# Altium schematic sheet Power_tree_page.SchDoc
size A3; SheetNumber: 3; SheetTotal: 5
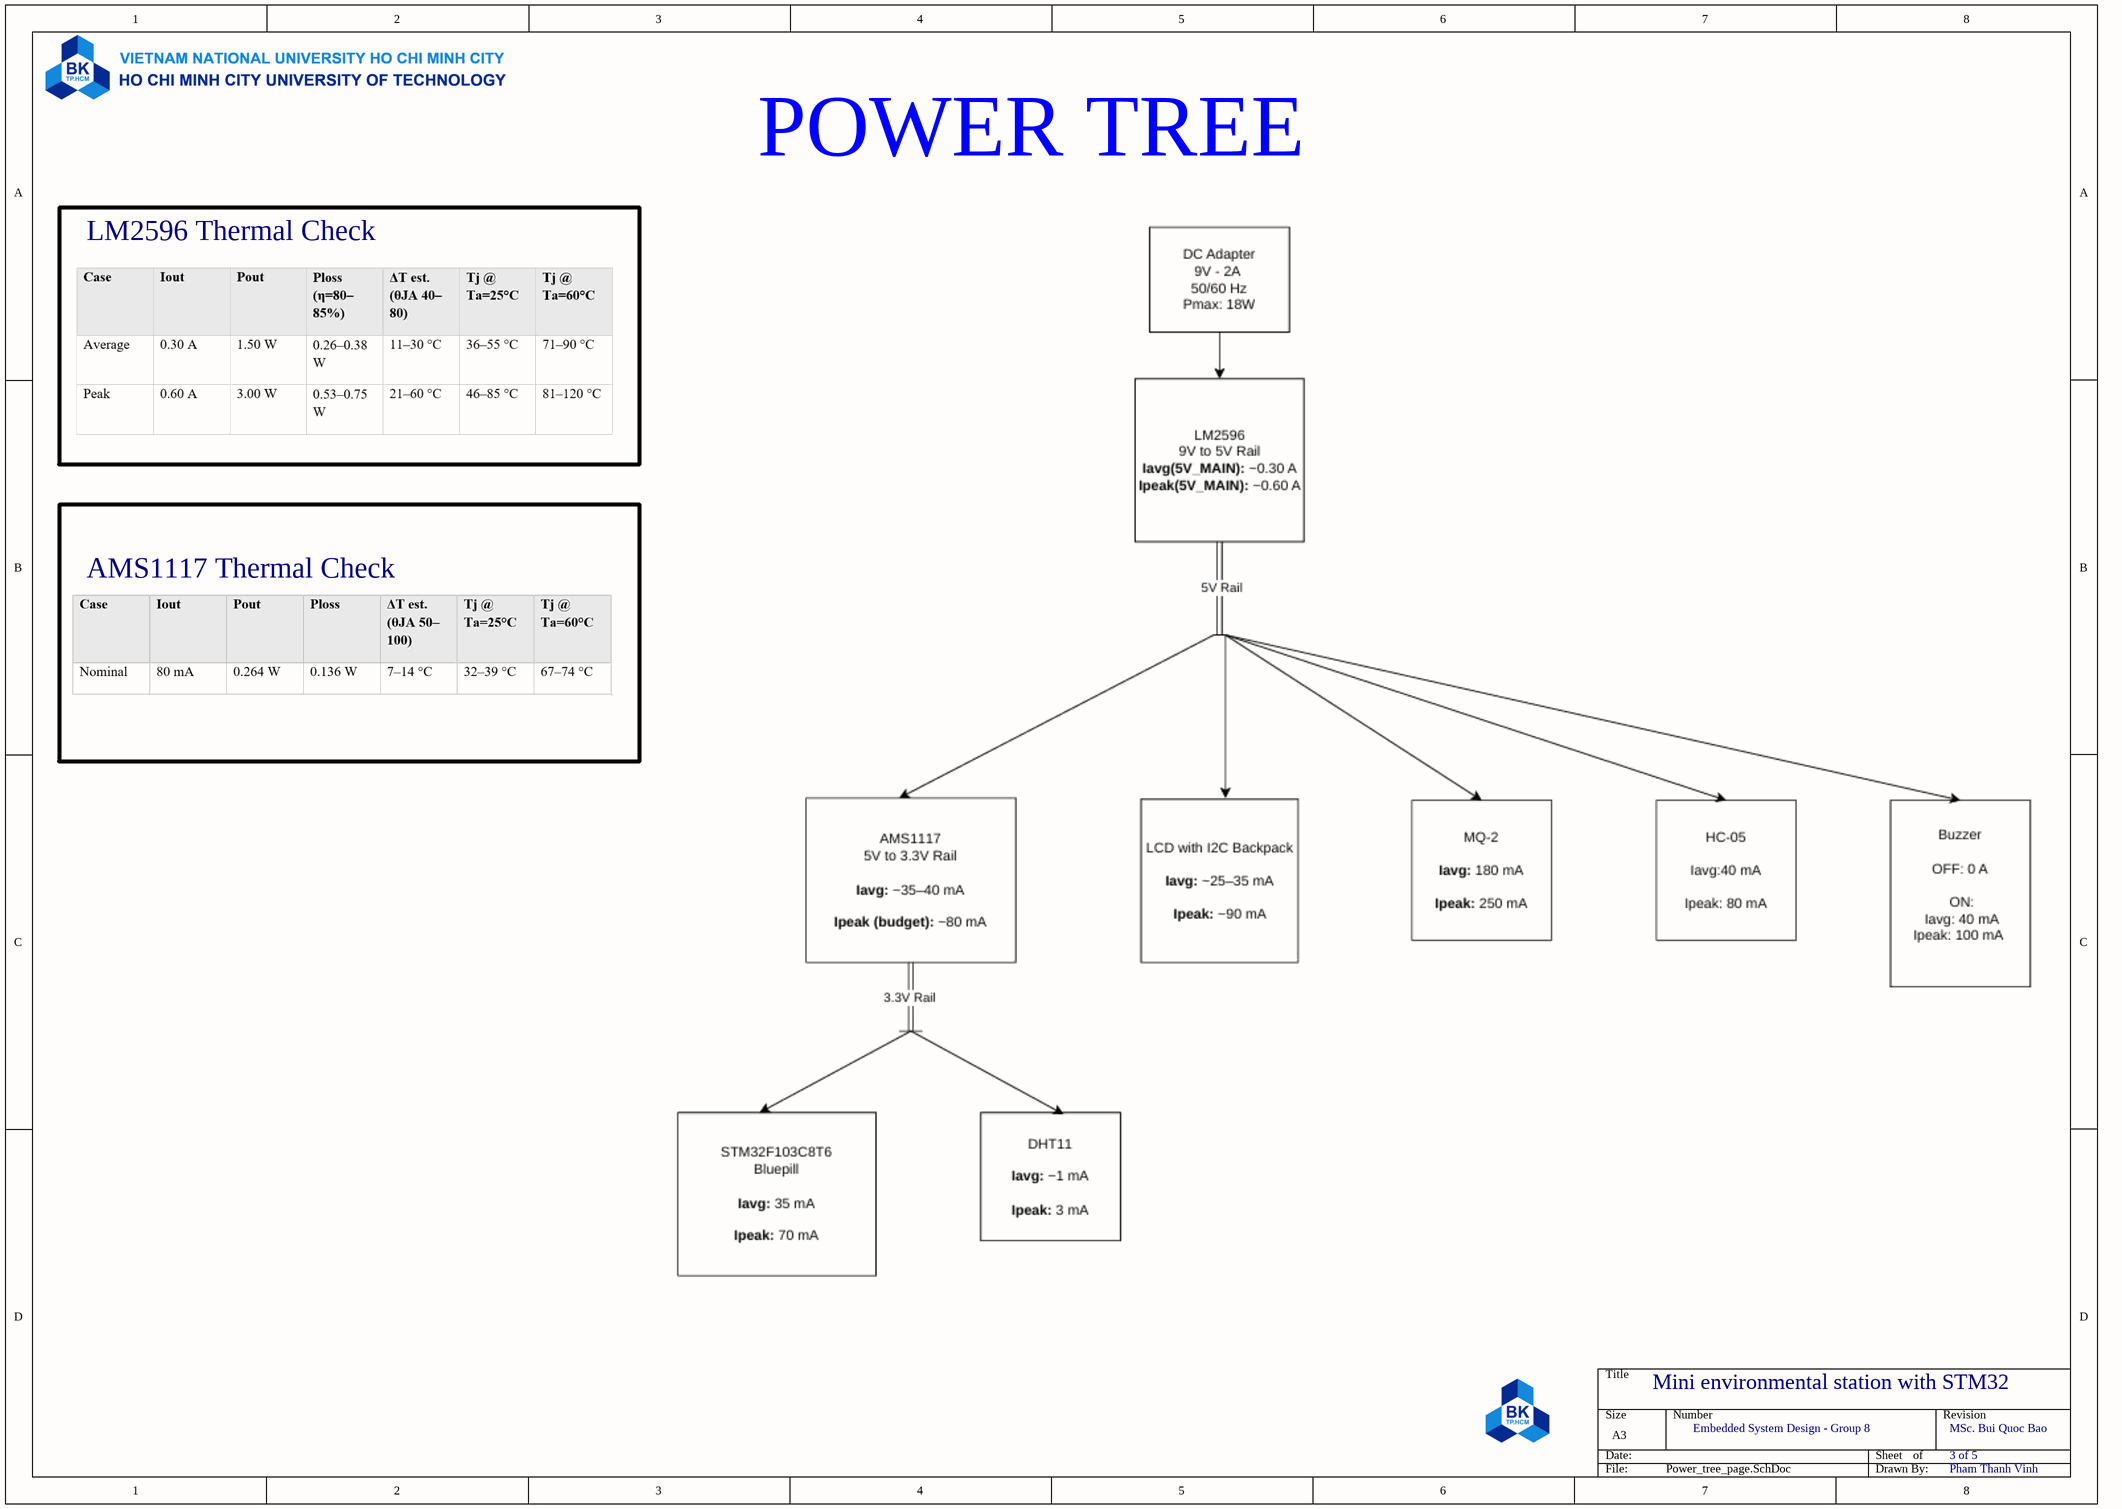
[diagram p0: Power_tree_page.SchDoc]

## Notes on the sheet
- POWER TREE
- LM2596 Thermal Check
- AMS1117 Thermal Check
- Mini environmental station with STM32
- Embedded System Design - Group 8
- MSc. Bui Quoc Bao
- 3 of 5
- Pham Thanh Vinh